# Altium schematic sheet PWR_CPU.SchDoc: Linefollower-Power
size A4; DrawnBy: Patryk Bujak; DocumentNumber: 12; Revision: 1.0; SheetNumber: 12; SheetTotal: 14
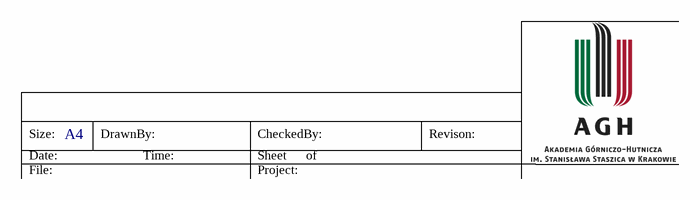
[diagram p0: PWR_CPU.SchDoc]

## Notes on the sheet
- Size:
- Date:
- A4
- DrawnBy:
- Time:
- Sheet
- CheckedBy:
- of
- Revison:
- File:
- Project: